# EAGLE schematic pc_pulse_v3 (EAGLE 6.6.0)
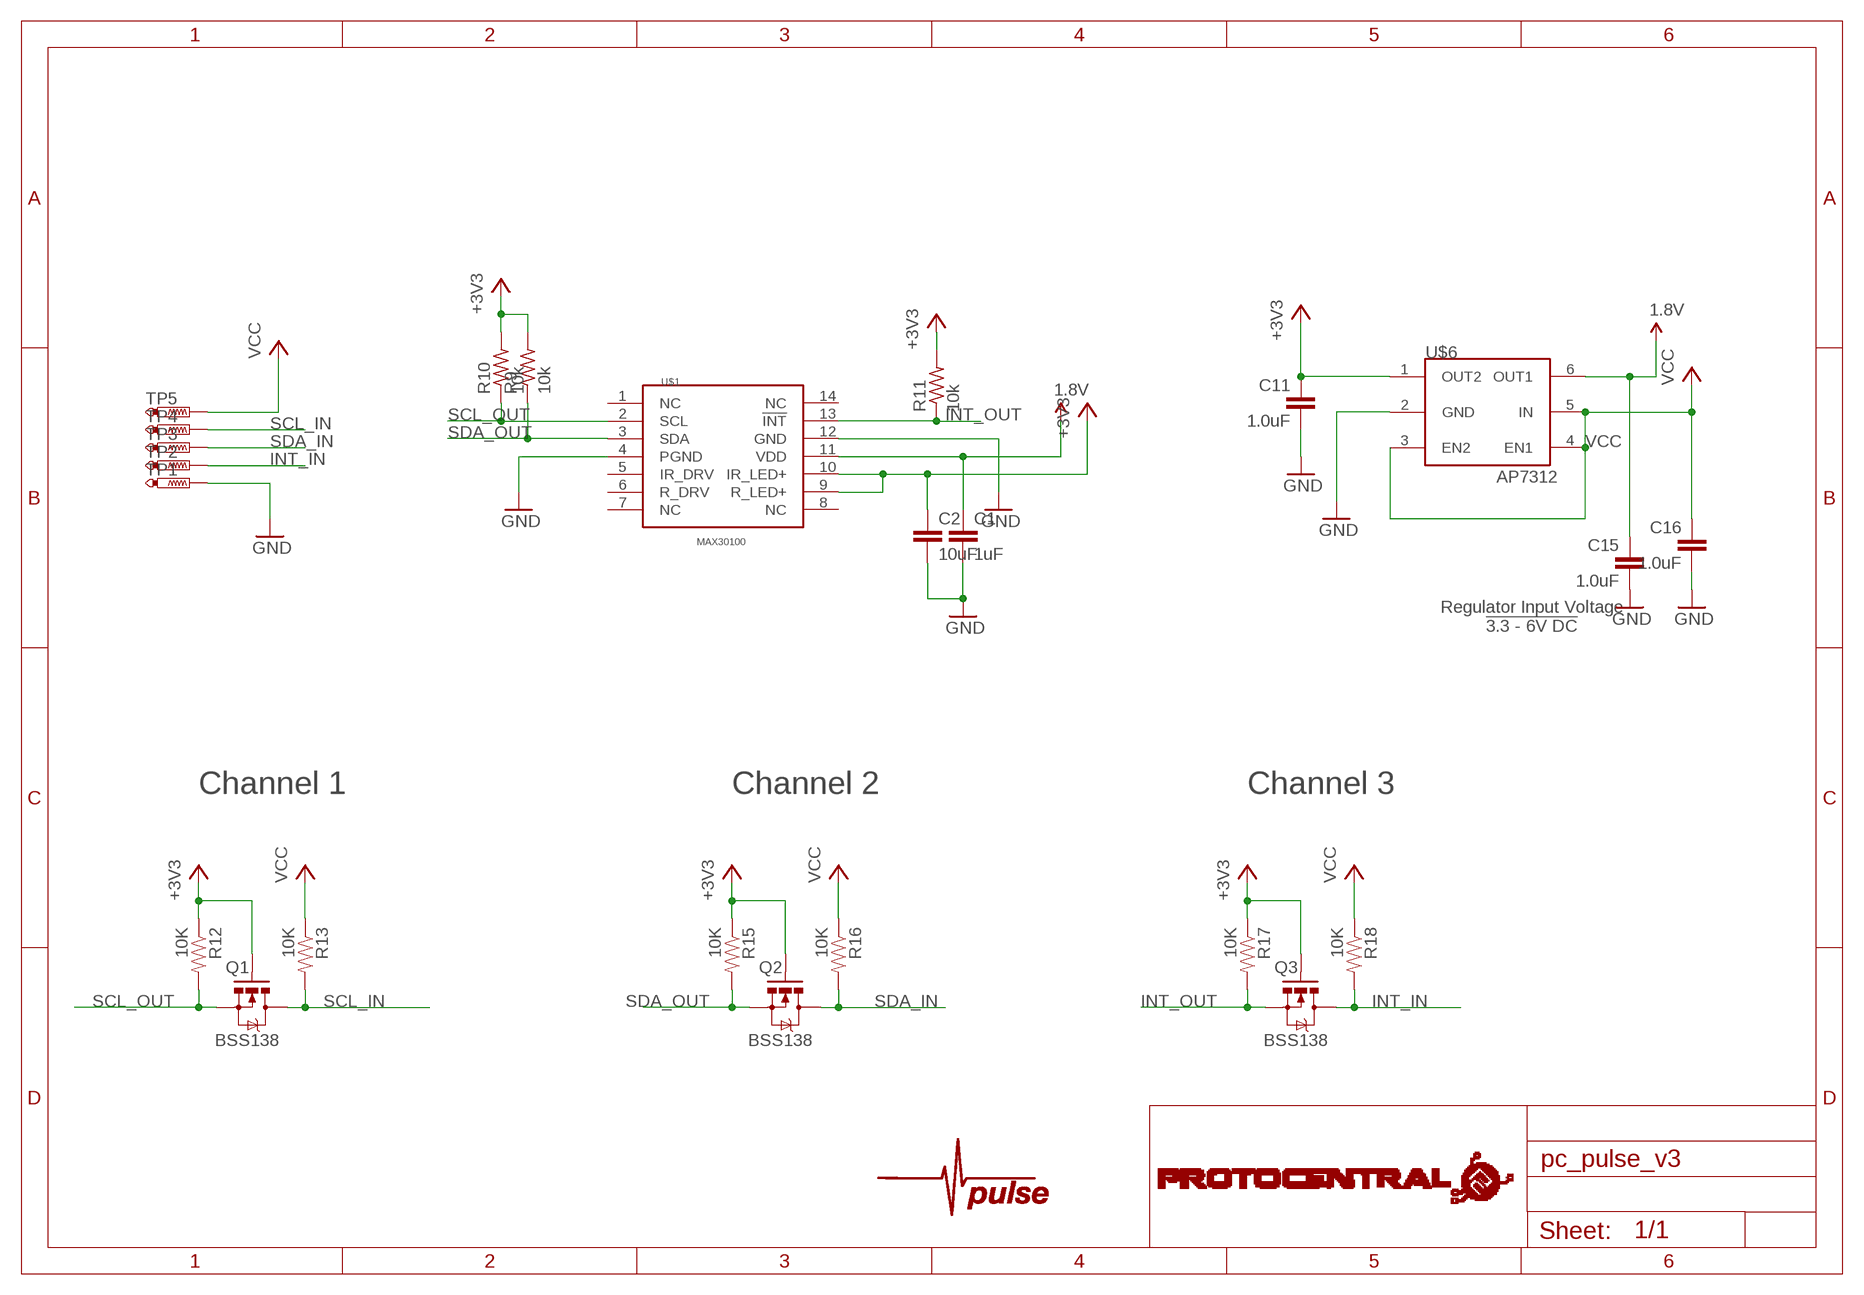
[diagram p0: schematic, sheet 1]

## Parts
C1  1uF  C-EUC0805  [C0805]
C2  10uF  C-EUC0805  [C0805]
C11  1.0uF  1.0UF-0805-25V-10%  [0805]
C15  1.0uF  1.0UF-0805-25V-10%  [0805]
C16  1.0uF  1.0UF-0805-25V-10%  [0805]
Q1  BSS138  MOSFET-NCHANNELSMD  [SOT23-3]
Q2  BSS138  MOSFET-NCHANNELSMD  [SOT23-3]
Q3  BSS138  MOSFET-NCHANNELSMD  [SOT23-3]
R9  10k  R-US_R0402  [R0402]
R10  10k  R-US_R0402  [R0402]
R11  10k  R-US_R0402  [R0402]
R12  10K  RESISTOR0402-RES  [0402-RES]
R13  10K  RESISTOR0402-RES  [0402-RES]
R15  10K  RESISTOR0402-RES  [0402-RES]
R16  10K  RESISTOR0402-RES  [0402-RES]
R17  10K  RESISTOR0402-RES  [0402-RES]
R18  10K  RESISTOR0402-RES  [0402-RES]
TP1  PTR1TP20SQ  [TP20SQ]
TP2  PTR1TP20SQ  [TP20SQ]
TP3  PTR1TP20SQ  [TP20SQ]
TP4  PTR1TP20SQ  [TP20SQ]
TP5  PTR1TP20SQ  [TP20SQ]
U$1  MAX30100  [OESIP-14]
U$3  PROTY-LOGO  [LOGO-PROTY]
U$4  PULSE  [PULSE]
U$6  AP7312  [SOT26]
U$7  PROTY_LOGO_WITH_TEXT  [PROTY_WITH_TEXT]

## Nets
1.8V: C1.1 C15.1 U$1.11(VDD) U$6.6(OUT1)
+3V3: C2.1 C11.1 Q1.1(G) Q2.1(G) Q3.1(G) R9.2 R10.2 R11.2 R12.1 R15.1 R17.1 U$1.9(R_LED+) U$1.10(IR_LED+) U$6.1(OUT2)
GND: C1.2 C2.2 C11.2 C15.2 C16.2 TP1.TP U$1.4(PGND) U$1.12(GND) U$6.2(GND)
INT_IN: Q3.3(D) R18.2 TP2.TP
INT_OUT: Q3.2(S) R11.1 R17.2 U$1.13(!INT)
SCL_IN: Q1.3(D) R13.2 TP4.TP
SCL_OUT: Q1.2(S) R10.1 R12.2 U$1.2(SCL)
SDA_IN: Q2.3(D) R16.2 TP3.TP
SDA_OUT: Q2.2(S) R9.1 R15.2 U$1.3(SDA)
VCC: C16.1 R13.1 R16.1 R18.1 TP5.TP U$6.3(EN2) U$6.4(EN1) U$6.5(IN)
Unconnected: U$1.1(NC) U$1.5(IR_DRV) U$1.6(R_DRV) U$1.7(NC) U$1.8(NC) U$1.14(NC)

## Notes on the sheet
- Regulator Input Voltage
  !3.3 - 6V DC!
- Channel 1 | Channel 2 | Channel 3

## Library data of the parts
C1 C2 = rcl:C-EU: CAPACITOR, European symbol
C11 C15 C16 = SparkFun-Capacitors:1.0UF: 1µF ceramic capacitors A capacitor is a passive two-terminal electrical component used to store electrical energy temporarily in an electric field.; PROD_ID: CAP-08064
Q1-Q3 = SparkFun:MOSFET-NCHANNEL
R9-R11 = rcl:R-US_: RESISTOR, American symbol
R12 R13 R15-R18 = SparkFun:RESISTOR: Resistor Basic schematic elements and footprints for 0603, 1206, and PTH resistors.
TP1-TP5 = testpad:PTR1: TEST PIN
U$1 = circuitects:MAX30100
U$3 = circuitects:PROTY-LOGO
U$4 = circuitects:PULSE
U$6 = circuitects:AP7312
U$7 = circuitects:PROTY_LOGO_WITH_TEXT